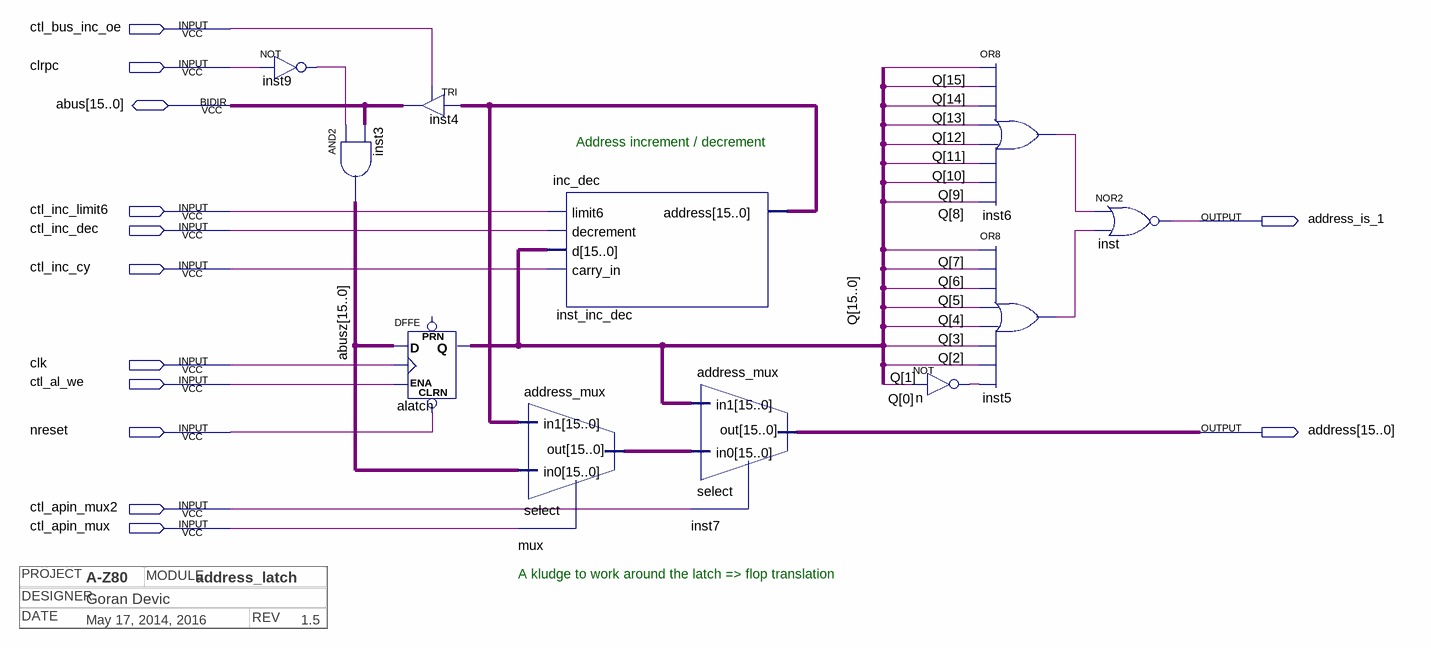
[diagram p0: schematic sheet]
// Quartus schematic address_latch.bdf as structural Verilog: 11 symbols, 13 pins
// Title block: DATE: May 17, 2014, 2016; DESIGNER: Goran Devic; MODULE: address_latch; PROJECT: A-Z80; REV: 1.5
module address_latch (
  input  ctl_bus_inc_oe,
  input  clrpc,
  input  ctl_inc_limit6,
  input  ctl_inc_dec,
  input  ctl_inc_cy,
  input  clk,
  input  ctl_al_we,
  input  nreset,
  input  ctl_apin_mux2,
  input  ctl_apin_mux,
  inout  [15:0] abus,
  output address_is_1,
  output [15:0] address
);

  wire inst5_out, inst6_out, inst9_out, n_out;
  wire [15:0] abusz, inst_inc_dec_address, mux_out, Q;

  not inst9 (inst9_out, clrpc);
  assign abusz = {16{inst9_out}} & abus;  // AND2 inst3, 16 bits wide
  TRI inst4[15:0] (.IN(inst_inc_dec_address), .OE(ctl_bus_inc_oe), .OUT(abus));
  DFFE alatch[15:0] (.CLRN(nreset), .D(abusz), .CLK(clk), .ENA(ctl_al_we), .Q(Q));  // open: PRN
  address_mux mux (.in1(inst_inc_dec_address), .in0(abusz), .select(ctl_apin_mux), .out(mux_out));
  inc_dec inst_inc_dec (
    .limit6(ctl_inc_limit6), .decrement(ctl_inc_dec), .d(Q), .carry_in(ctl_inc_cy),
    .address(inst_inc_dec_address));
  address_mux inst7 (.in1(Q), .in0(mux_out), .select(ctl_apin_mux2), .out(address));
  or inst6 (inst6_out, Q[15], Q[14], Q[13], Q[12], Q[11], Q[10], Q[9], Q[8]);
  or inst5 (inst5_out, Q[7], Q[6], Q[5], Q[4], Q[3], Q[2], Q[1], n_out);
  not n (n_out, Q[0]);
  nor inst (address_is_1, inst6_out, inst5_out);

  // Notes on the sheet:
  //   Address increment / decrement
  //   A kludge to work around the latch => flop translation
endmodule
